# Altium project Template.PrjPCB
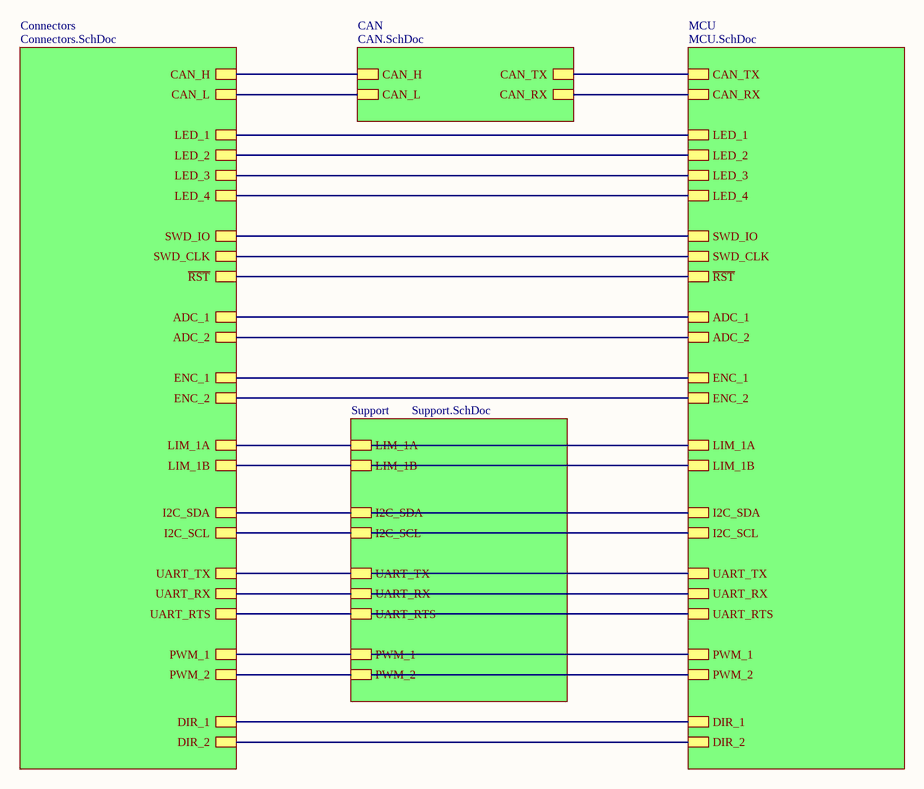
[diagram p0: Template.SchDoc]
4 sheets, 41 parts. Net scope: hierarchical (ports join the sheet entries above them; power ports are global).
Sheets:
  Template.SchDoc
    Connectors = Connectors.SchDoc
    CAN = CAN.SchDoc
    Support = Support.SchDoc

## Sheet Template.SchDoc
size A4

### Sub-sheets
CAN = CAN.SchDoc: CAN_H, CAN_L, CAN_TX, CAN_RX
Connectors = Connectors.SchDoc: CAN_H, CAN_L, LED_1, LED_2, LED_3, LED_4, SWD_IO, SWD_CLK, ~{RST}, ADC_1, ADC_2, ENC_1, ENC_2, LIM_1A, LIM_1B, I2C_SDA, I2C_SCL, UART_TX, UART_RX, UART_RTS, PWM_1, DIR_2, DIR_1, PWM_2
MCU = MCU.SchDoc (file not in this document): CAN_TX, CAN_RX, LED_1, LED_2, LED_3, LED_4, SWD_IO, SWD_CLK, ~{RST}, ADC_1, ADC_2, ENC_1, ENC_2, LIM_1A, LIM_1B, I2C_SDA, I2C_SCL, UART_TX, UART_RX, UART_RTS, PWM_1, DIR_2, DIR_1, PWM_2
Support = Support.SchDoc: LIM_1A, LIM_1B, I2C_SDA, I2C_SCL, UART_TX, UART_RX, UART_RTS, PWM_1, PWM_2

### Nets
CAN_H: sheet Connectors/CAN_H, sheet CAN/CAN_H
CAN_L: sheet Connectors/CAN_L, sheet CAN/CAN_L
I2C_SCL: sheet Connectors/I2C_SCL, sheet Support/I2C_SCL
I2C_SDA: sheet Connectors/I2C_SDA, sheet Support/I2C_SDA
LIM_1A: sheet Connectors/LIM_1A, sheet Support/LIM_1A
LIM_1B: sheet Connectors/LIM_1B, sheet Support/LIM_1B
UART_RTS: sheet Connectors/UART_RTS, sheet Support/UART_RTS
UART_RX: sheet Connectors/UART_RX, sheet Support/UART_RX
UART_TX: sheet Connectors/UART_TX, sheet Support/UART_TX
NetJ?#3_1: sheet Connectors/PWM_1, sheet Support/PWM_1
NetJ?#3_2: sheet Connectors/DIR_1, sheet MCU/DIR_1
NetJ?#4_1: sheet Connectors/PWM_2, sheet Support/PWM_2
NetJ?#4_2: sheet Connectors/DIR_2, sheet MCU/DIR_2
NetJ?#9_1: sheet Connectors/ADC_1, sheet MCU/ADC_1
NetJ?#9_2: sheet Connectors/ADC_2, sheet MCU/ADC_2
NetJ?#12_1: sheet Connectors/SWD_IO, sheet MCU/SWD_IO
NetJ?#12_2: sheet Connectors/SWD_CLK, sheet MCU/SWD_CLK
NetJ?#12_3: sheet Connectors/~{RST}, sheet MCU/~{RST}
NetU?_1: sheet CAN/CAN_TX, sheet MCU/CAN_TX
NetU?_4: sheet CAN/CAN_RX, sheet MCU/CAN_RX
(unnamed): sheet Connectors/LED_1, sheet MCU/LED_1
(unnamed): sheet Connectors/LED_2, sheet MCU/LED_2
(unnamed): sheet Connectors/LED_3, sheet MCU/LED_3
(unnamed): sheet Connectors/LED_4, sheet MCU/LED_4
(unnamed): sheet Connectors/ENC_1, sheet MCU/ENC_1
(unnamed): sheet Connectors/ENC_2, sheet MCU/ENC_2

## Sheet Connectors.SchDoc
size A4
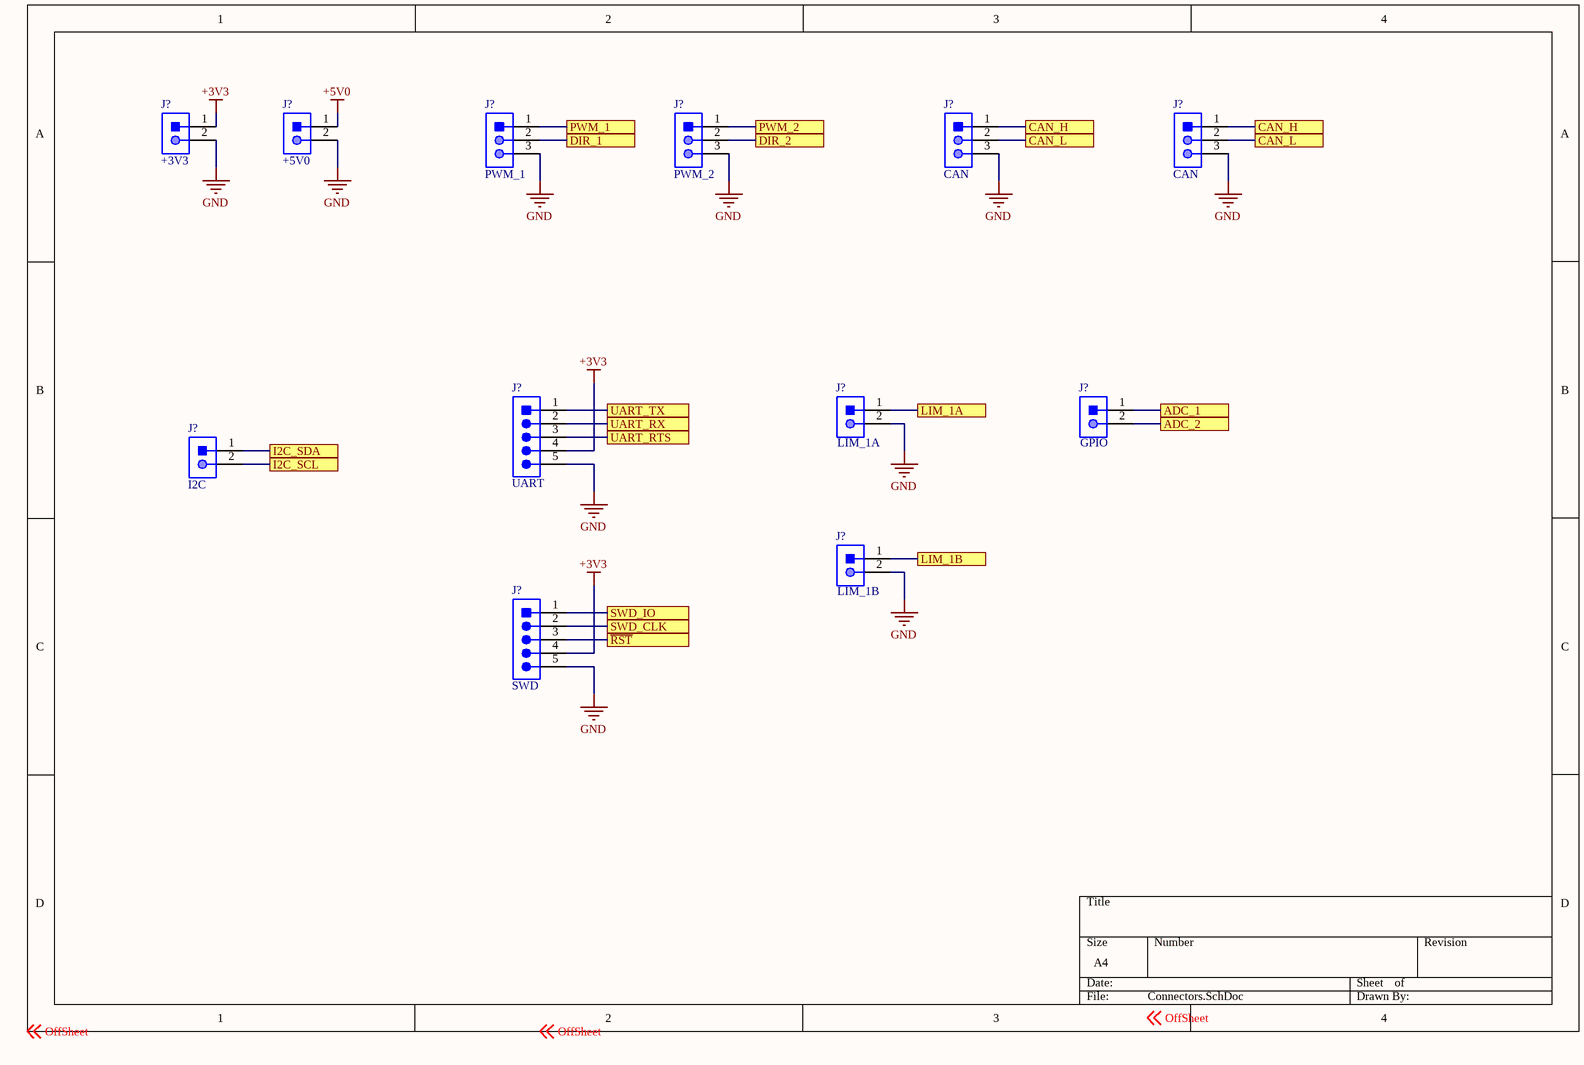
[diagram p1: Connectors.SchDoc]

### Parts
(Parts that share a designator on the sheet are numbered #1, #2 ... from top to bottom, then left to right.)
J?#1  +3V3
J?#2  +5V0
J?#3  PWM_1
J?#4  PWM_2
J?#5  CAN
J?#6  CAN
J?#7  UART
J?#8  LIM_1A
J?#9  GPIO
J?#10  I2C
J?#11  LIM_1B
J?#12  SWD

### Ports
ADC_1, ADC_2, CAN_H, CAN_L, DIR_1, DIR_2, I2C_SCL, I2C_SDA, LIM_1A, LIM_1B, PWM_1, PWM_2, SWD_CLK, SWD_IO, UART_RTS, UART_RX, UART_TX, ~{RST}

### Nets
+3V3: J?#1.1 J?#7.4 J?#12.4
+5V0: J?#2.1
GND: J?#1.2 J?#2.2 J?#3.3 J?#4.3 J?#5.3 J?#6.3 J?#7.5 J?#8.2 J?#11.2 J?#12.5
CAN_H: J?#5.1 J?#6.1 ; port CAN_H
CAN_L: J?#5.2 J?#6.2 ; port CAN_L
I2C_SCL: J?#10.2 ; port I2C_SCL
I2C_SDA: J?#10.1 ; port I2C_SDA
LIM_1A: J?#8.1 ; port LIM_1A
LIM_1B: J?#11.1 ; port LIM_1B
UART_RTS: J?#7.3 ; port UART_RTS
UART_RX: J?#7.2 ; port UART_RX
UART_TX: J?#7.1 ; port UART_TX
NetJ?#3_1: J?#3.1 ; port PWM_1
NetJ?#3_2: J?#3.2 ; port DIR_1
NetJ?#4_1: J?#4.1 ; port PWM_2
NetJ?#4_2: J?#4.2 ; port DIR_2
NetJ?#9_1: J?#9.1 ; port ADC_1
NetJ?#9_2: J?#9.2 ; port ADC_2
NetJ?#12_1: J?#12.1 ; port SWD_IO
NetJ?#12_2: J?#12.2 ; port SWD_CLK
NetJ?#12_3: J?#12.3 ; port ~{RST}

### Notes on the sheet
- Labels drawn without touching a wire or pin: OffSheet

### Library data of the parts
J?#1 J?#2 J?#8-J?#11 = CON_2M_PH_SIDE_SMT: CONN HEADER PH SIDE 2POS 2MM SMD; Manufacturer: JST; Part Number: S2B-PH-SM4-TB; ComponentLink1Description: Datasheet; ComponentLink1URL: http://www.jst-mfg.com/product/pdf/eng/ePH.pdf
J?#3-J?#6 = CON_3M_PH_SIDE_SMT: CONN HEADER PH SIDE 3POS 2MM SMD; Manufacturer: JST; Part Number: B3B-PH-SM4-TB; ComponentLink1Description: Datasheet; ComponentLink1URL: http://www.jst-mfg.com/product/pdf/eng/ePH.pdf
J?#7 J?#12 = CON_5M_PH_SIDE_TH: CONN HEADER PH SIDE 5POS 2MM; Manufacturer: JST; Part Number: S5B-PH-K-S; ComponentLink1Description: Datasheet; ComponentLink1URL: http://www.jst-mfg.com/product/pdf/eng/ePH.pdf

## Sheet CAN.SchDoc
size A4
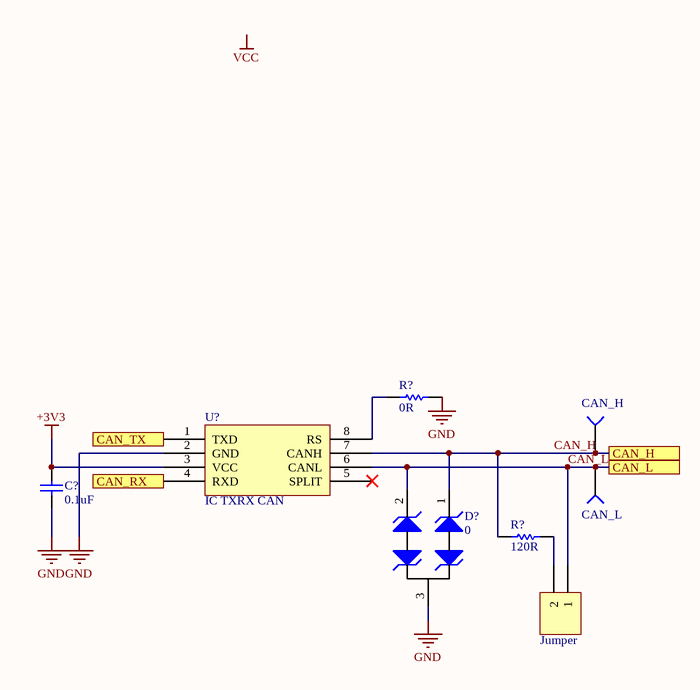
[diagram p2: CAN.SchDoc]

### Parts
(Parts that share a designator on the sheet are numbered #1, #2 ... from top to bottom, then left to right.)
?  Jumper  [HDR1X2]
C?  value 0.1uF  [CAPC0603(1608)55_N]  (hidden comment: CAP_0.1uF_16V_0603)
D?#1  0
R?#1  value 0R  [RESC0201(0603)_N]  (hidden comment: RES_0R_0603)
R?#2  value 120R  [RESC0201(0603)_N]  (hidden comment: RES_120R_0603)
TP?#1  CAN_H  [TESTPOINT]
TP?#2  CAN_L  [TESTPOINT]
U?  IC TXRX CAN

### Ports
CAN_H, CAN_L, CAN_RX, CAN_TX

### Nets
+3V3: C?.2 U?.3(VCC)
GND: C?.1 D?#1.3 R?#1.2 U?.2(GND)
CAN_H: D?#1.1 R?#2.1 TP?#1.1(=value) U?.7(CANH) ; port CAN_H
CAN_L: ?.1 D?#1.2 TP?#2.1(=value) U?.6(CANL) ; port CAN_L
Net?_2: ?.2 R?#2.2
NetR?#1_1: R?#1.1 U?.8(RS)
NetU?_1: U?.1(TXD) ; port CAN_TX
NetU?_4: U?.4(RXD) ; port CAN_RX

Not connected (* = marked no-connect by the designer): U? 5(SPLIT)*

### Notes on the sheet
- Labels drawn without touching a wire or pin: VCC

### Library data of the parts
? = Header 2: Header, 2-Pin; LatestRevisionDate: 17-Jul-2002; LatestRevisionNote: Re-released for DXP Platform.; Publisher: Altium Limited
C? = CAP_0.1uF_16V_0603: CAP CER 0.1UF 16V X7R 0603; Part Number: CC0603KRX7R7BB104; Manufacturer: Yageo; Dimensions: 0.063" L x 0.031" W (1.60mm x 0.80mm); Package: 0603 (1608 Metric); Temperature Coefficient: X7R; Voltage Rating: 16V
D?#1 = TVS_DIODE_CAN: TVS DIODE 24V 50V SOT323-3; Part Number: PESD1CAN-UX; Manufacturer: Nexperia USA Inc.; Package: SC-70, SOT-323; ComponentLink1Description: Datasheet; ComponentLink1URL: https://assets.nexperia.com/documents/data-sheet/PESD1CAN-U.pdf
R?#1 = RES_0R_0603: RES SMD 0 OHM JUMPER 1/10W 0603; Manufacturer: Yageo; Part Number (MPN): RC0603JR-070RL; Package: 0603 (1608 Metric); Dimensions: 0.063" L x 0.031" W (1.60mm x 0.80mm)
R?#2 = RES_120R_0603: RES SMD 120 OHM 5% 1/10W 0603; Manufacturer: Yageo; Part Number (MPN): RC0603JR-07120RL; Package: 0603 (1608 Metric); Dimensions: 0.063" L x 0.031" W (1.60mm x 0.80mm); Tolerance: 5%
TP?#1 TP?#2 = TESTPOINT_SMD
U? = LTC2875: IC TXRX CAN 4MBPS 8SO; Manufacturer: Linear Technologies; Part Number: LTC2875IS8#PBF; Package: 8-SOIC (0.154", 3.90mm Width); ComponentLink1Description: Datasheet; ComponentLink1URL: https://www.analog.com/media/en/technical-documentation/data-sheets/2875f.pdf

## Sheet Support.SchDoc
size A4
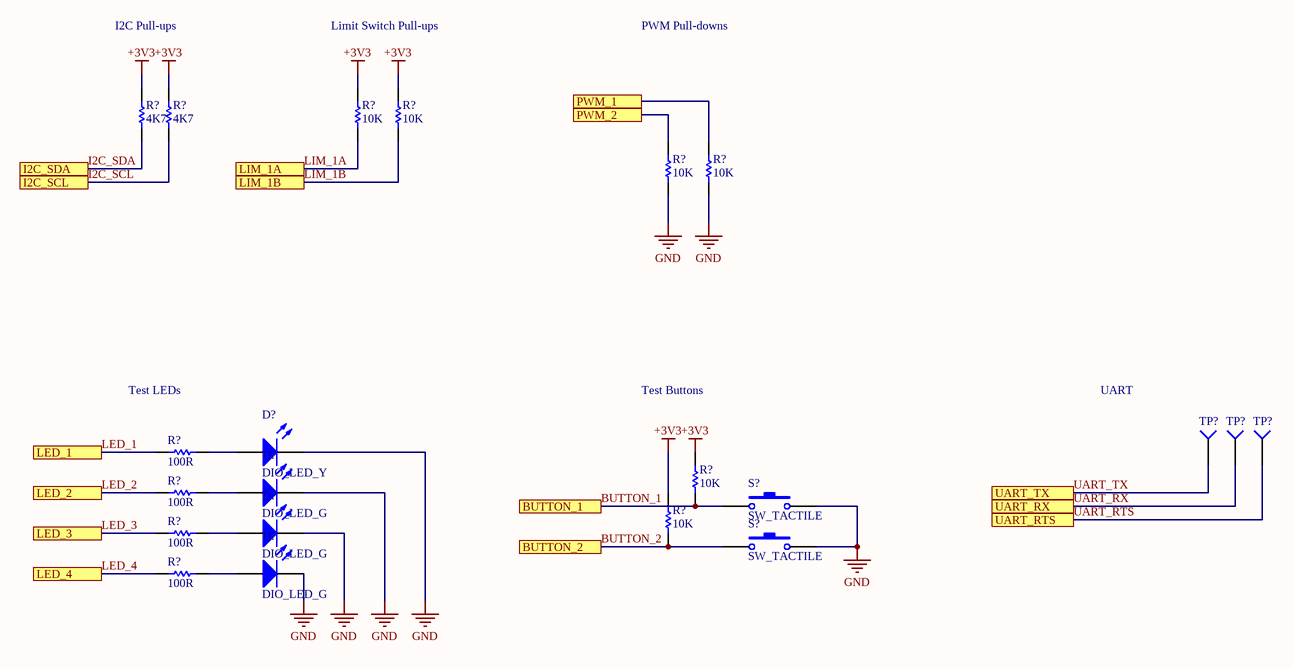
[diagram p3: Support.SchDoc]

### Parts
(Parts that share a designator on the sheet are numbered #1, #2 ... from top to bottom, then left to right.)
D?#2  DIO_LED_Y  [LED_0805]
D?#3  DIO_LED_G  [LED_0805]
D?#4  DIO_LED_G  [LED_0805]
D?#5  DIO_LED_G  [LED_0805]
R?#3  value 4K7  [RESC0201(0603)_N]  (hidden comment: RES_4K7_0603)
R?#4  value 4K7  [RESC0201(0603)_N]  (hidden comment: RES_4K7_0603)
R?#5  value 10K  [RESC0201(0603)_N]  (hidden comment: RES_10K_0603)
R?#6  value 10K  [RESC0201(0603)_N]  (hidden comment: RES_10K_0603)
R?#7  value 10K  [RESC0201(0603)_N]  (hidden comment: RES_10K_0603)
R?#8  value 10K  [RESC0201(0603)_N]  (hidden comment: RES_10K_0603)
R?#9  value 100R  [RESC0201(0603)_N]  (hidden comment: RES_100R_0603)
R?#10  value 100R  [RESC0201(0603)_N]  (hidden comment: RES_100R_0603)
R?#11  value 10K  [RESC0201(0603)_N]  (hidden comment: RES_10K_0603)
R?#12  value 10K  [RESC0201(0603)_N]  (hidden comment: RES_10K_0603)
R?#13  value 100R  [RESC0201(0603)_N]  (hidden comment: RES_100R_0603)
R?#14  value 100R  [RESC0201(0603)_N]  (hidden comment: RES_100R_0603)
S?#1  SW_TACTILE  [SPST-2]
S?#2  SW_TACTILE  [SPST-2]
TP?#3  TESTPOINT  (value not drawn)
TP?#4  TESTPOINT  (value not drawn)
TP?#5  TESTPOINT  (value not drawn)

### Ports
BUTTON_1, BUTTON_2, I2C_SCL, I2C_SDA, LED_1, LED_2, LED_3, LED_4, LIM_1A, LIM_1B, PWM_1, PWM_2, UART_RTS, UART_RX, UART_TX

### Nets
+3V3: R?#3.2 R?#4.2 R?#5.2 R?#6.2 R?#11.2 R?#12.1
GND: D?#2.2(K) D?#3.2(K) D?#4.2(K) D?#5.2(K) R?#7.1 R?#8.1 S?#1.2 S?#2.2
BUTTON_1: R?#11.1 S?#1.1 ; port BUTTON_1
BUTTON_2: R?#12.2 S?#2.1 ; port BUTTON_2
I2C_SCL: R?#4.1 ; port I2C_SCL
I2C_SDA: R?#3.1 ; port I2C_SDA
LED_1: R?#9.1 ; port LED_1
LED_2: R?#10.1 ; port LED_2
LED_3: R?#13.1 ; port LED_3
LED_4: R?#14.1 ; port LED_4
LIM_1A: R?#5.1 ; port LIM_1A
LIM_1B: R?#6.1 ; port LIM_1B
UART_RTS: TP?#5.1(=value) ; port UART_RTS
UART_RX: TP?#4.1(=value) ; port UART_RX
UART_TX: TP?#3.1(=value) ; port UART_TX
NetD?#2_1: D?#2.1(A) R?#9.2
NetD?#3_1: D?#3.1(A) R?#10.2
NetD?#4_1: D?#4.1(A) R?#13.2
NetD?#5_1: D?#5.1(A) R?#14.2
NetJ?#3_1: R?#8.2 ; port PWM_1
NetJ?#4_1: R?#7.2 ; port PWM_2

### Notes on the sheet
- I2C Pull-ups
- Limit Switch Pull-ups
- PWM Pull-downs
- Test LEDs
- Test Buttons
- UART

### Library data of the parts
D?#2 = DIO_LED_Y: LED YELLOW DIFFUSED 0805 SMD; Part Number: LY R976-PS-36; Manufacturer: OSRAM; Forward Voltage Drop: 2.2V; Package: 0805 (2012 Metric)
D?#3-D?#5 = DIO_LED_G: LED GREEN DIFFUSED 0805 SMD; Part Number: LG R971-KN-1; Manufacturer: OSRAM; Forward Voltage Drop: 2.2V; Package: 0805 (2012 Metric)
R?#3 R?#4 = RES_4K7_0603: RES SMD 4.7K OHM 5% 1/10W 0603; Manufacturer: Yageo; Part Number (MPN): RC0603JR-074K7L; Package: 0603 (1608 Metric); Dimensions: 0.063" L x 0.031" W (1.60mm x 0.80mm); Tolerance: 5%
R?#5-R?#8 R?#11 R?#12 = RES_10K_0603: RES SMD 10K OHM 5% 1/10W 0603; Manufacturer: Yageo; Part Number (MPN): RC0603JR-0710KL; Package: 0603 (1608 Metric); Dimensions: 0.063" L x 0.031" W (1.60mm x 0.80mm); Tolerance: 5%
R?#9 R?#10 R?#13 R?#14 = RES_100R_0603: RES SMD 100 OHM 1% 1/10W 0603; Manufacturer: Yageo; Part Number (MPN): RC0603FR-07100RL; Package: 0603 (1608 Metric); Dimensions: 0.063" L x 0.031" W (1.60mm x 0.80mm); Tolerance: 1%
S?#1 S?#2 = SW_TACTILE: Switch; Published: 24-Mar-1999; LatestRevisionDate: 17-Jul-2002; LatestRevisionNote: Re-released for DXP Platform.; PackageReference: SPST-2; Publisher: Altium Limited; PackageDescription: Switch; 2 Leads

## Nets that join several sheets
+3V3: Connectors (J?#1.1 J?#7.4 J?#12.4), CAN (C?.2 U?.3), Support (6 pins)
GND: Connectors (10 pins), CAN (C?.1 D?#1.3 R?#1.2 U?.2), Support (8 pins)
CAN_H: Connectors (J?#5.1 J?#6.1), CAN (D?#1.1 R?#2.1 TP?#1.1 U?.7)
CAN_L: Connectors (J?#5.2 J?#6.2), CAN (?.1 D?#1.2 TP?#2.1 U?.6)
I2C_SCL: Connectors (J?#10.2), Support (R?#4.1)
I2C_SDA: Connectors (J?#10.1), Support (R?#3.1)
LIM_1A: Connectors (J?#8.1), Support (R?#5.1)
LIM_1B: Connectors (J?#11.1), Support (R?#6.1)
NetJ?#3_1: Connectors (J?#3.1), Support (R?#8.2)
NetJ?#4_1: Connectors (J?#4.1), Support (R?#7.2)
UART_RTS: Connectors (J?#7.3), Support (TP?#5.1)
UART_RX: Connectors (J?#7.2), Support (TP?#4.1)
UART_TX: Connectors (J?#7.1), Support (TP?#3.1)